# EAGLE design ctr_brd (EAGLE 9.6.2)
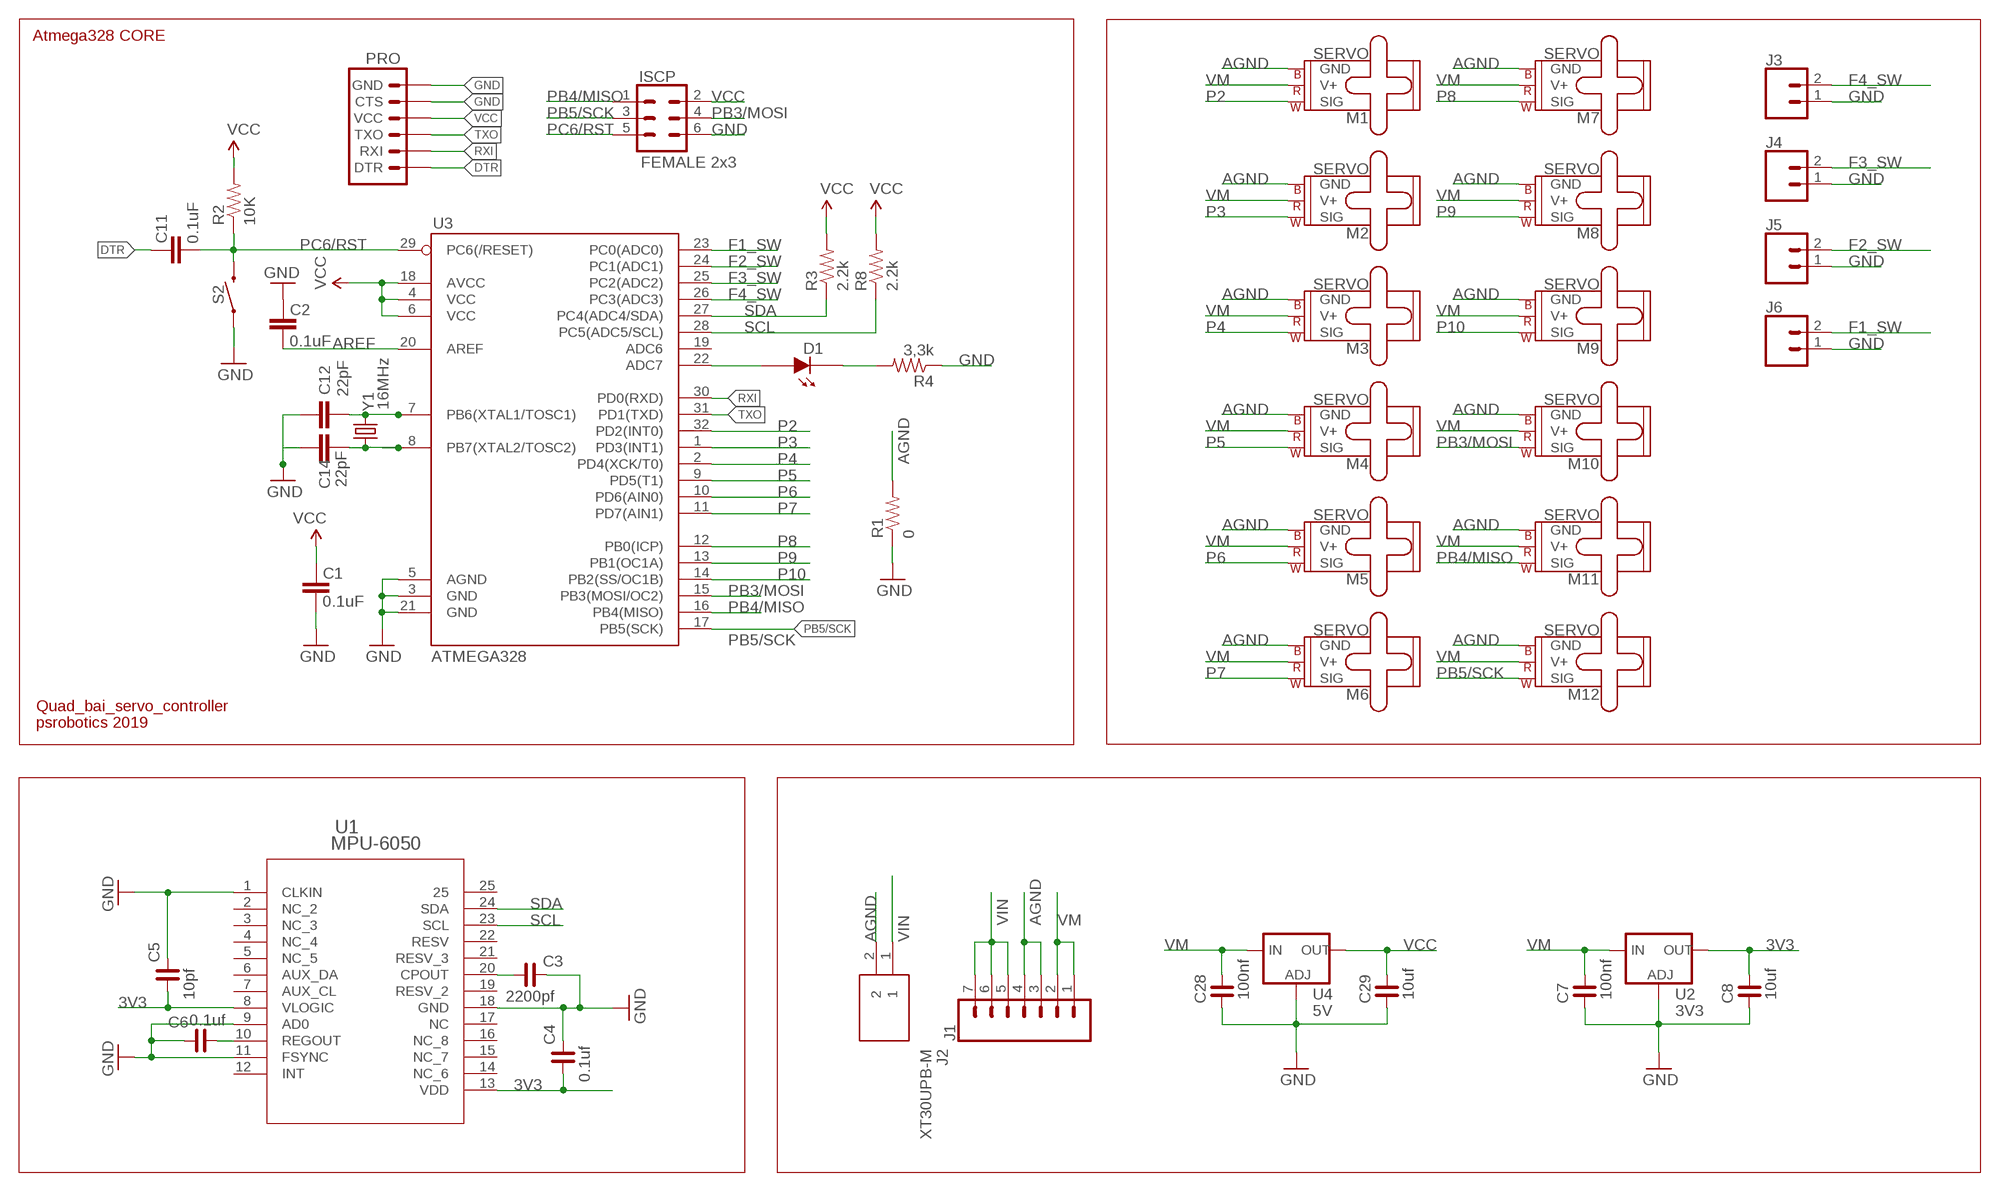
[diagram p0: schematic, sheet 1]

## Parts
C1  0.1uF  CAP0603-CAP  [0603-CAP]
C2  0.1uF  CAP0603-CAP  [0603-CAP]
C3  2200pf  C_0603  [C0603]
C4  0.1uf  C_0603  [C0603]
C5  10pf  C_0603  [C0603]
C6  0.1uf  C_0603  [C0603]
C7  100nf  C_0603  [C0603]
C8  10uf  C_0603  [C0603]
C11  0.1uF  CAP0603-CAP  [0603-CAP]
C12  22pF  22PF-0603-50V-5%  [0603]
C14  22pF  22PF-0603-50V-5%  [0603]
C28  100nf  C_0603  [C0603]
C29  10uf  C_0603  [C0603]
D1  LEDB  [0603P]
ISCP  FEMALE 2x3  CONN_03X2FEMALE  [2X3]
J1  CONN_07LONGPADS  [1X07_LONGPADS]
J2  XT30UPB-M  [SHDR2W160P0X500_1X2_1020X520X1]
J3  CONN_02LOCK  [1X02_LOCK]
J4  CONN_02LOCK  [1X02_LOCK]
J5  CONN_02LOCK  [1X02_LOCK]
J6  CONN_02LOCK  [1X02_LOCK]
M1  SERVO  [1X03]
M2  SERVO  [1X03]
M3  SERVO  [1X03]
M4  SERVO  [1X03]
M5  SERVO  [1X03]
M6  SERVO  [1X03]
M7  SERVO  [1X03]
M8  SERVO  [1X03]
M9  SERVO  [1X03]
M10  SERVO  [1X03]
M11  SERVO  [1X03]
M12  SERVO  [1X03]
PRO  FTDI Basic  ARDUINO_SERIAL_PROGRAMPTH  [1X06]
R1  0  RESISTOR0603-RES  [0603-RES]
R2  10K  RESISTOR0603-RES  [0603-RES]
R3  2.2k  RESISTOR0603-RES  [0603-RES]
R4  3,3k  RESISTOR0603-RES  [0603-RES]
R8  2.2k  RESISTOR0603-RES  [0603-RES]
S2  MOMENTARY-SWITCH-SPST-SMD-6.0X3.5MM  [TACTILE_SWITCH_SMD_6.0X3.5MM]
U1  MPU-6050  [QFN24_4X4X0P9_IVS]
U2  3V3  V_REG_LM1117SOT223  [SOT223]
U3  ATMEGA328  ATMEGA168  [TQFP32-08]
U4  5V  V_REG_LM1117SOT223  [SOT223]
Y1  16MHz  CRYSTAL-16MHZSMD-5X3.2  [CRYSTAL-SMD-5X3.2-4PAD]

## Nets
3V3: C4.1 C5.1 C8.2 U1.8(VLOGIC) U1.13(VDD) U2.2(OUT) U2.4(OUT)
AGND: J1.3 J1.4 J2.2 M1.3(GND) M2.3(GND) M3.3(GND) M4.3(GND) M5.3(GND) M6.3(GND) M7.3(GND) M8.3(GND) M9.3(GND) M10.3(GND) M11.3(GND) M12.3(GND) R1.2
AREF: C2.1 U3.20(AREF)
DTR: C11.2 PRO.1(DTR)
F1_SW: J6.2 U3.23(PC0(ADC0))
F2_SW: J5.2 U3.24(PC1(ADC1))
F3_SW: J4.2 U3.25(PC2(ADC2))
F4_SW: J3.2 U3.26(PC3(ADC3))
GND: C1.1 C2.2 C3.2 C4.2 C5.2 C6.2 C7.1 C8.1 C12.1 C14.1 C28.1 C29.1 ISCP.6 J3.1 J4.1 J5.1 J6.1 PRO.5(CTS) PRO.6(GND) R1.1 R4.1 S2.1 U1.1(CLKIN) U1.9(AD0) U1.11(FSYNC) U1.18(GND) U2.1(ADJ) U3.3(GND) U3.5(AGND) U3.21(GND) U4.1(ADJ)
N$1: C14.2 U3.8(PB7(XTAL2/TOSC2)) Y1.1
N$2: C12.2 U3.7(PB6(XTAL1/TOSC1)) Y1.3
N$3: C3.1 U1.20(CPOUT)
N$4: C6.1 U1.10(REGOUT)
N$5: D1.1(D_IN) U3.22(ADC7)
N$6: D1.2(D_OUT) R4.2
P2: M1.1(SIG) U3.32(PD2(INT0))
P3: M2.1(SIG) U3.1(PD3(INT1))
P4: M3.1(SIG) U3.2(PD4(XCK/T0))
P5: M4.1(SIG) U3.9(PD5(T1))
P6: M5.1(SIG) U3.10(PD6(AIN0))
P7: M6.1(SIG) U3.11(PD7(AIN1))
P8: M7.1(SIG) U3.12(PB0(ICP))
P9: M8.1(SIG) U3.13(PB1(OC1A))
P10: M9.1(SIG) U3.14(PB2(SS/OC1B))
PB3/MOSI: ISCP.4 M10.1(SIG) U3.15(PB3(MOSI/OC2))
PB4/MISO: ISCP.1 M11.1(SIG) U3.16(PB4(MISO))
PB5/SCK: ISCP.3 M12.1(SIG) U3.17(PB5(SCK))
PC6/RST: C11.1 ISCP.5 R2.1 S2.2 U3.29(PC6(/RESET))
RXI: PRO.2(RXI) U3.30(PD0(RXD))
SCL: R8.1 U1.23(SCL) U3.28(PC5(ADC5/SCL))
SDA: R3.1 U1.24(SDA) U3.27(PC4(ADC4/SDA))
TXO: PRO.3(TXO) U3.31(PD1(TXD))
VCC: C1.2 C29.2 ISCP.2 PRO.4(VCC) R2.2 R3.2 R8.2 U3.4(VCC) U3.6(VCC) U3.18(AVCC) U4.2(OUT) U4.4(OUT)
VIN: J1.5 J1.6 J1.7 J2.1
VM: C7.2 C28.2 J1.1 J1.2 M1.2(V+) M2.2(V+) M3.2(V+) M4.2(V+) M5.2(V+) M6.2(V+) M7.2(V+) M8.2(V+) M9.2(V+) M10.2(V+) M11.2(V+) M12.2(V+) U2.3(IN) U4.3(IN)
Unconnected: U1.2(NC_2) U1.3(NC_3) U1.4(NC_4) U1.5(NC_5) U1.6(AUX_DA) U1.7(AUX_CL) U1.12(INT) U1.14(NC_6) U1.15(NC_7) U1.16(NC_8) U1.17(NC) U1.19(RESV_2) U1.21(RESV_3) U1.22(RESV) U1.25 U3.19(ADC6)

## Notes on the sheet
- Atmega328 CORE
- Quad_bai_servo_controller
- psrobotics 2019

## Library data of the parts
C1 C2 C11 = SparkFun:CAP: Capacitor Standard 0603 ceramic capacitor, and 0.1" leaded capacitor.
C3-C8 C28 C29 = rc-master-smd:C_: NON-POLARIZED CAP
C12 C14 = SparkFun-Capacitors:22PF: 22pF ceramic capacitors A capacitor is a passive two-terminal electrical component used to store electrical energy temporarily in an electric field.; PROD_ID: CAP-07876
D1 = m-pad-2.1:LED: LED's in various packages
ISCP = SparkFun-Connectors:CONN_03X2: Multi connection point. Often used as Generic Header-pin footprint for 0.1 inch spaced/style header connections You can populate with any combo of single row headers, but if you'd like an exact match, check these: Header - 2x3 (Male, 0.1") <https://www.sparkfun.com/products/12807> (PRT-12807) Header - 2x3 (Female, 0.1") <https://www.sparkfun.com/products/13010> (PRT-13010) 2x3 Pin Shrouded Header <https://www.sparkfun.com/products/10877> (PRT-10877) On any of the 0.1 inch spaced packages, you can populate with these: Break Away Headers - Straight <https://www.sparkfun.com/products/116> (PRT-00116) Break Away Male Headers - Right Angle <https://www.sparkfun.com/products/553> (PRT-00553) Female Headers <https://www.sparkfun.com/products/115> (PRT-00115) Break Away Headers - Machine Pin <https://www.sparkfun.com/products/117> (PRT-00117) Break Away Female Headers - Swiss Machine Pin <https://www.sparkfun.com/products/743> (PRT-00743) Special note: the shrouded connector mates well with our 3x2 ribbon cables: Ribbon Crimp Connector - 6-pin (2x3, Female) <https://www.sparkfun.com/products/10651> (PRT-10651) Ribbon Cable - 6 wire (15ft) <https://www.sparkfun.com/products/10646> (PRT-10646); PROD_ID: CONN-11566
J1 = SparkFun-Connectors:CONN_07: Multi connection point. Often used as Generic Header-pin footprint for 0.1 inch spaced/style header connections On any of the 0.1 inch spaced packages, you can populate with these: Break Away Headers - Straight <https://www.sparkfun.com/products/116> (PRT-00116) Break Away Male Headers - Right Angle <https://www.sparkfun.com/products/553> (PRT-00553) Female Headers <https://www.sparkfun.com/products/115> (PRT-00115) Break Away Headers - Machine Pin <https://www.sparkfun.com/products/117> (PRT-00117) Break Away Female Headers - Swiss Machine Pin <https://www.sparkfun.com/products/743> (PRT-00743) For SCREWTERMINALS and SPRING TERMINALS visit here: Screw Terimnals on SparkFun.com <https://www.sparkfun.com/search/results?term=Screw+Terminals> (5mm/3.5mm/2.54mm spacing) This device is also useful as a general connection point to wire up your design to another part of your project. Our various solder wires solder well into these plated through hole pads. Hook-Up Wire - Assortment (Stranded, 22 AWG) <https://www.sparkfun.com/products/11375> (PRT-11375) Hook-Up Wire - Assortment (Solid Core, 22 AWG) <https://www.sparkfun.com/products/11367> (PRT-11367) View the entire wire category on our website here <https://www.sparkfun.com/categories/141> Special notes: Molex polarized connector foot print use with SKU : PRT-08231 with associated crimp pins and housings. 1MM SMD Version SKU: PRT-10208 NOTES ON THE VARIANTS LOCK and LOCK_LONGPADS... This footprint was designed to help hold the alignment of a through-hole component (i.e. 6-pin header) while soldering it into place. You may notice that each hole has been shifted either up or down by 0.005 of an inch from it's more standard position (which is a perfectly straight line). This slight alteration caused the pins (the squares in the middle) to touch the edges of the holes. Because they are alternating, it causes a "brace" to hold the component in place. 0.005 has proven to be the perfect amount of "off-center" position when using our standard breakaway headers. Although looks a little odd when you look at the bare footprint, once you have a header in there, the alteration is very hard to notice. Also,if you push a header all the way into place, it is covered up entirely on the bottom side.
J2 = XT30UPB-M:XT30UPB-M: Socket; DC supply; XT30; male; PIN: 2; on PCBs; THT; Colour: yellow Source: Datasheet <https://www.tme.eu/Document/4acc913878197f8c2e30d4b8cdc47230/XT30UPB SPEC.pdf>; DESCRIPTION: Socket; DC supply; XT30; male; PIN: 2; on PCBs; THT; Colour: yellow; HEIGHT: 10.7mm; MANUFACTURER_NAME: Amass; MANUFACTURER_PART_NUMBER: XT30UPB-M
J3-J6 = SparkFun-Connectors:CONN_02: Multi connection point. Often used as Generic Header-pin footprint for 0.1 inch spaced/style header connections On any of the 0.1 inch spaced packages, you can populate with these: Break Away Headers - Straight <https://www.sparkfun.com/products/116> (PRT-00116) Break Away Male Headers - Right Angle <https://www.sparkfun.com/products/553> (PRT-00553) Female Headers <https://www.sparkfun.com/products/115> (PRT-00115) Break Away Headers - Machine Pin <https://www.sparkfun.com/products/117> (PRT-00117) Break Away Female Headers - Swiss Machine Pin <https://www.sparkfun.com/products/743> (PRT-00743) For SCREWTERMINALS and SPRING TERMINALS visit here: Screw Terimnals on SparkFun.com <https://www.sparkfun.com/search/results?term=Screw+Terminals> (5mm/3.5mm/2.54mm spacing) This device is also useful as a general connection point to wire up your design to another part of your project. Our various solder wires solder well into these plated through hole pads. Hook-Up Wire - Assortment (Stranded, 22 AWG) <https://www.sparkfun.com/products/11375> (PRT-11375) Hook-Up Wire - Assortment (Solid Core, 22 AWG) <https://www.sparkfun.com/products/11367> (PRT-11367) View the entire wire category on our website here <https://www.sparkfun.com/categories/141> Special notes: Molex polarized connector foot print use with: PRT-08233 with associated crimp pins and housings. 2.54_SCREWTERM for use with PRT-10571. 3.5mm Screw Terminal footprints for PRT-08084 5mm Screw Terminal footprints for use with PRT-08432
M1-M12 = SparkFun-Electromechanical:SERVO: Servo Motor 3-pin connector for a standard servo motor (voltage supply, ground, and control signal.) SparkFun Products Servo - Generic (Sub-Micro Size) <https://www.sparkfun.com/products/9065> (ROB-09065) Servo - Generic High Torque Continuous Rotation (Standard Size) <https://www.sparkfun.com/products/9347> (ROB-09347) Servo - Generic High Torque (Standard Size) <https://www.sparkfun.com/products/11965> (ROB-11965)
PRO = SparkFun:ARDUINO_SERIAL_PROGRAM
R1-R4 R8 = SparkFun:RESISTOR: Resistor Basic schematic elements and footprints for 0603, 1206, and PTH resistors.
S2 = SparkFun-Switches:MOMENTARY-SWITCH-SPST: Momentary Switch (Pushbutton) - SPST Normally-open (NO) SPST momentary switches (buttons, pushbuttons). Variants PTH-12MM - 12mm square, through-hole Momentary Pushbutton Switch - 12mm Square <https://www.sparkfun.com/products/9190> (COM-09190) PTH-6.0MM, PTH-6.0MM-KIT - 6.0mm square, through-hole Mini Pushbutton Switch <https://www.sparkfun.com/products/97> (COM-00097) KIT package intended for soldering kit's - only one side of pads' copper is exposed. PTH-RIGHT-ANGLE-KIT - Right-angle, through-hole Right Angle Tactile Button <https://www.sparkfun.com/products/10791> - Used on SparkFun BigTime Watch Kit <https://www.sparkfun.com/products/11734> SMD-12MM - 12mm square, surface-mount Tactile Button - SMD (12mm) <https://www.sparkfun.com/products/12993> (COM-12993) Used on SparkFun PicoBoard <https://www.sparkfun.com/products/11888> SMD-4.5MM - 4.5mm Square Trackball Switch Used on SparkFun Blackberry Trackballer Breakout <https://www.sparkfun.com/products/13169> SMD-4.6MMX2.8MM - 4.60mm x 2.80mm, surface mount Used on SparkFun SAMD21 Mini Breakout <https://www.sparkfun.com/products/13664> SMD-5.2MM, SMD-5.2-REDUNDANT - 5.2mm square, surface-mount Mini Pushbutton Switch - SMD <https://www.sparkfun.com/products/8720> (COM-08720) Used on Arduino Pro Mini <https://www.sparkfun.com/products/11114> REDUNDANT package connects both switch circuits together SMD-6.0X3.5MM - 6.0 x 3.5mm, surface mount Momentary Reset Switch SMD <https://www.sparkfun.com/products/8229> (COM-08229) SMD-6.2MM-TALL - 6.2mm square, surface mount Tactile Button - SMD (6mm) <https://www.sparkfun.com/products/12992> Used on SparkFun Digital Sandbox <https://www.sparkfun.com/products/12651> SMD-RIGHT-ANGLE - Right-angle, surface mount Used on SparkFun Block for Intel® Edison - Arduino <https://www.sparkfun.com/products/13036>; PROD_ID: SWCH-00815; SF_SKU: COM-08229
U1 = MPU6050:MPU-6050; BUILT_BY: EMA_Cory; COPYRIGHT: Copyright (C) 2018 Accelerated Designs. All rights reserved; MANUFACTURER_PART_NUMBER: MPU-6050; SOURCELIBRARY: InvenSense_2019-12-03; VENDOR: IvenSense
U2 U4 = SparkFun-IC-Power:V_REG_LM1117: Voltage Regulator LM1117 Standard adjustable voltage regulator but in SMD form. Spark Fun Electronics SKU : COM-00595; PROD_ID: VREG-08170
U3 = SparkFun:ATMEGA168
Y1 = SparkFun-Clocks:CRYSTAL-16MHZ: 16MHz Crystal Digikey Example <http://www.digikey.com/product-search/en?keywords=535-9122-1-ND> Frequency: 16MHz Frequency Stability: ±50ppm Frequency Tolerance: ±20ppm Load Capacitance: 18pF SparkFun Products: Pro Micro -5V/16MHz <https://www.sparkfun.com/products/12640> SparkFun Serial Enabled LCD Kit <https://www.sparkfun.com/products/10097>; PROD_ID: XTAL-08218; SF_ID: COM-00094

## Net classes
0 default: width 0.203 mm
1 vcc: width 0.254 mm

## Board
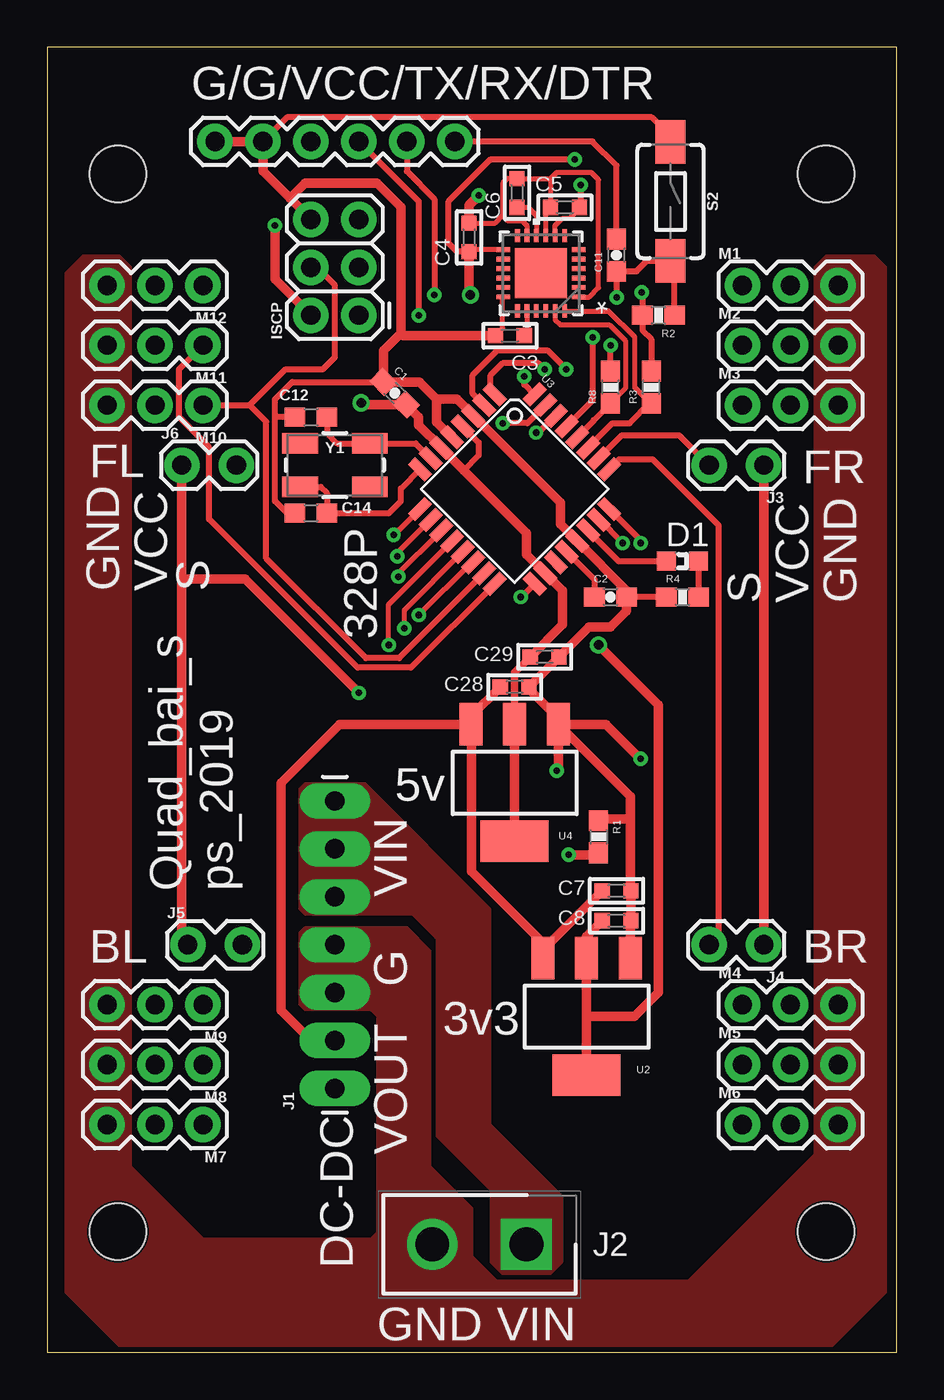
[diagram p1: board, top side]
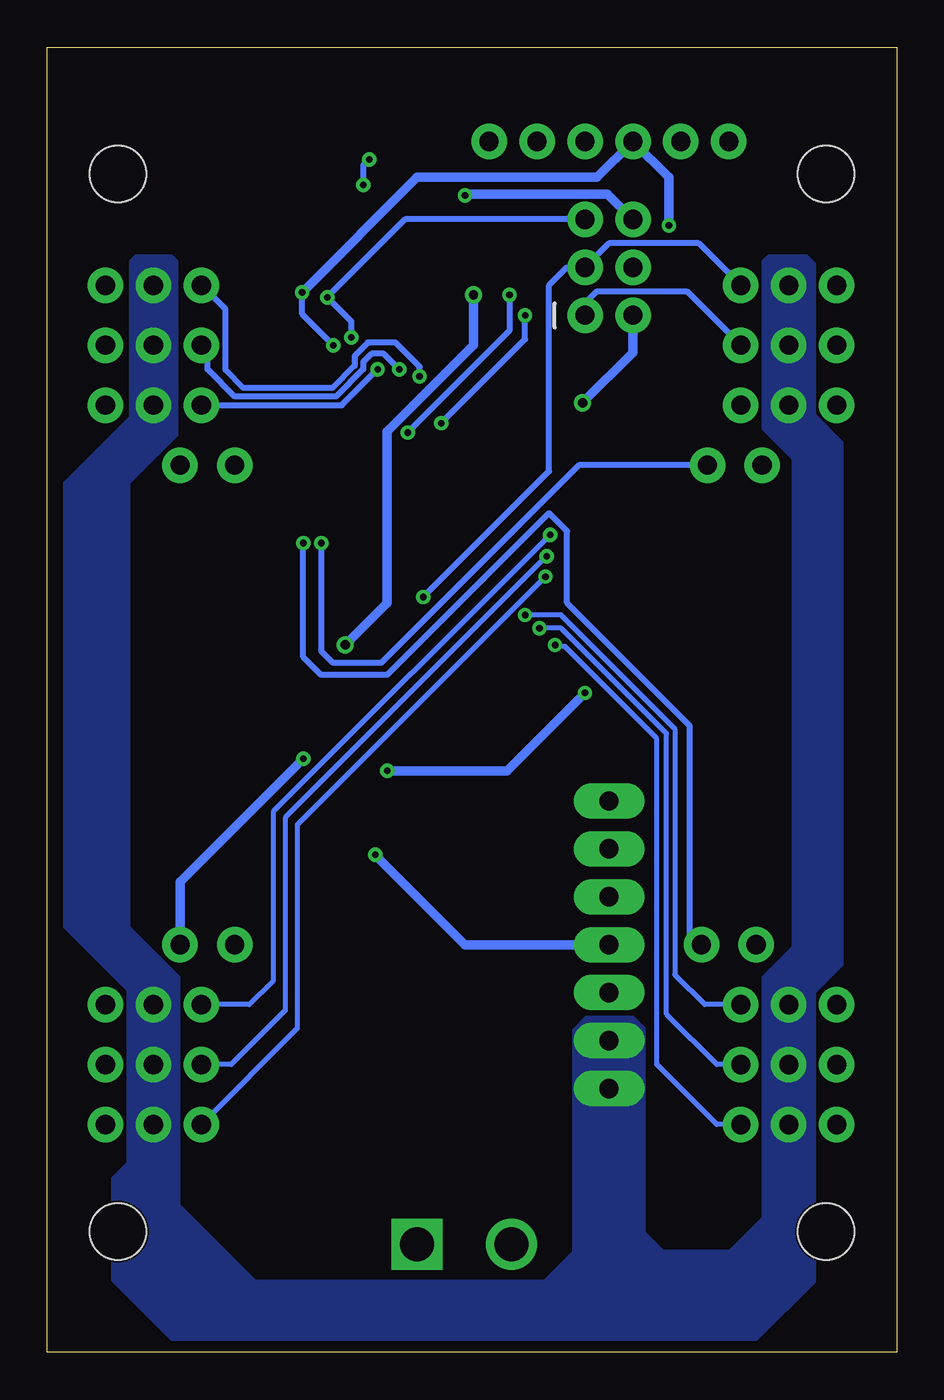
[diagram p2: board, bottom side, seen from below]

Size 45 x 69.13 mm. Coordinates in mm from the lower left corner, seen from the top.
Outline: 0,0 45,0 45,69.13 0,69.13 0,0
Copper layers (1*16): Top 0.035mm / dielectric 1.5mm / Bottom 0.035mm
Design rules "default *": minimum track width 6mil, minimum drill 0.35mm, track to track 6mil, track to pad 6mil, pad to pad 6mil, via to via 6mil, smd to smd 6mil, copper to edge 5mil, drill to drill 6mil, minimum pad ring 10mil, minimum via ring 8mil, stop-mask expansion 4mil, vias tented up to drill 22mil, thermal gap 10mil
Holes 3 mm at 3.75,6.41 3.75,62.41 41.25,6.41 41.25,62.41

### Footprints (pad centres in the part's own frame; a part is rotated, then mirrored left to right if it is on the bottom)
0603-CAP = smd 1.1 x 1: 1 -0.85,0; 2 0.85,0
C0603 = smd 0.8 x 0.8: 1 -0.762,0; 2 0.762,0
0603 = smd 1.1 x 1: 1 -0.85,0; 2 0.85,0
0603P = smd 1 x 1: 1 -0.85,0; 2 0.85,0
2X3 = drill 1.016 pad 1.88: 1 0,0; 2 0,2.54; 3 2.54,0; 4 2.54,2.54; 5 5.08,0; 6 5.08,2.54
1X07_LONGPADS = drill 1.016 pad 1.88 long: 1 0,0; 2 2.54,0; 3 5.08,0; 4 7.62,0; 5 10.16,0; 6 12.7,0; 7 15.24,0
SHDR2W160P0X500_1X2_1020X520X1 = drill 1.8 pad 2.7 square: 1 0,0 | drill 1.8 pad 2.7: 2 5,0
1X02_LOCK = drill 1.016 pad 1.88: 1 -0.178,0; 2 2.718,0
1X03 = drill 1.016 pad 1.88: 1 0,0; 2 2.54,0; 3 5.08,0
1X06 = drill 1.016 pad 1.88: 1 0,0; 2 2.54,0; 3 5.08,0; 4 7.62,0; 5 10.16,0; 6 12.7,0
0603-RES = smd 1.1 x 1: 1 -0.85,0; 2 0.85,0
TACTILE_SWITCH_SMD_6.0X3.5MM = smd 2.3 x 1.6: 1 -3.15,0; 2 3.15,0
QFN24_4X4X0P9_IVS = smd 0.711 x 0.254: 1 -1.994,1.25; 2 -1.994,0.75; 3 -1.994,0.25; 4 -1.994,-0.25; 5 -1.994,-0.75; 6 -1.994,-1.25; 13 1.994,-1.25; 14 1.994,-0.75; 15 1.994,-0.25; 16 1.994,0.25; 17 1.994,0.75; 18 1.994,1.25 | smd 0.254 x 0.711: 7 -1.25,-1.994; 8 -0.75,-1.994; 9 -0.25,-1.994; 10 0.25,-1.994; 11 0.75,-1.994; 12 1.25,-1.994; 19 1.25,1.994; 20 0.75,1.994; 21 0.25,1.994; 22 -0.25,1.994; 23 -0.75,1.994; 24 -1.25,1.994 | smd 2.743 x 2.642: 25 0,0
SOT223 = smd 1.219 x 2.235: 1 -2.311,-3.099; 2 0,-3.099; 3 2.311,-3.099 | smd 3.6 x 2.2: 4 0,3.099
TQFP32-08 = smd 1.27 x 0.559: 1 -4.293,2.8; 2 -4.293,2; 3 -4.293,1.2; 4 -4.293,0.4; 5 -4.293,-0.4; 6 -4.293,-1.2; 7 -4.293,-2; 8 -4.293,-2.8; 17 4.293,-2.8; 18 4.293,-2; 19 4.293,-1.2; 20 4.293,-0.4; 21 4.293,0.4; 22 4.293,1.2; 23 4.293,2; 24 4.293,2.8 | smd 0.559 x 1.27: 9 -2.8,-4.293; 10 -2,-4.293; 11 -1.2,-4.293; 12 -0.4,-4.293; 13 0.4,-4.293; 14 1.2,-4.293; 15 2,-4.293; 16 2.8,-4.293; 25 2.8,4.293; 26 2,4.293; 27 1.2,4.293; 28 0.4,4.293; 29 -0.4,4.293; 30 -1.2,4.293; 31 -2,4.293; 32 -2.8,4.293
CRYSTAL-SMD-5X3.2-4PAD = smd 1.9 x 1.1: 1 -1.85,-1.15; 2 1.85,-1.15; 3 1.85,1.15; 4 -1.85,1.15

### Placement (x,y rotation side)
C1  18.41,50.8 315 top
C2  29.84,40.01 0 top
C3  24.51,53.85 180 top
C4  22.35,59.05 90 top
C5  27.43,60.64 180 top
C6  24.89,61.4 90 top
C7  30.16,24.45 180 top
C8  30.16,22.86 180 top
C11  30.16,58.1 90 top
C12  13.97,49.53 0 top
C14  13.97,44.45 0 top
C28  24.77,35.24 180 top
C29  26.35,36.83 180 top
D1  33.66,41.91 0 top
ISCP  16.51,54.93 90 top
J1  15.24,13.97 90 top
J2  25.4,5.71 180 top
J3  37.78,46.99 180 top
J4  37.78,21.59 180 top
J5  7.62,21.59 0 top
J6  7.3,46.99 0 top
M1  36.83,56.52 0 top
M2  36.83,53.34 0 top
M3  36.83,50.16 0 top
M4  36.83,18.42 0 top
M5  36.83,15.24 0 top
M6  36.83,12.06 0 top
M7  8.26,12.06 180 top
M8  8.26,15.24 180 top
M9  8.26,18.42 180 top
M10  8.26,50.16 180 top
M11  8.26,53.34 180 top
M12  8.26,56.52 180 top
PRO  21.59,64.13 180 top
R1  29.21,27.3 270 top
R2  32.38,54.93 180 top
R3  32,51.12 90 top
R4  33.66,40.01 0 top
R8  29.84,51.12 90 top
S2  33.02,60.96 270 top
U1  26.16,57.15 180 top
U2  28.57,17.78 180 top
U3  24.77,45.72 315 top
U4  24.77,30.16 180 top
Y1  15.24,46.99 0 top

### Tracks (layer width: path | path; a pad name or v marks a point on that pad's centre or on a via)
3V3  (via drill 0.35, 0.5)
  Top 0.254: U1.8 26.91,59.68 27.3,60.07 27.69,60.07 28.19,60.58 C5.1 | U1.13 22.46,58.4 C4.1
  Top 0.305: C4.1 21.72,58.29 21.27,58.74 21.27,60.96 23.5,63.18 v27.94,63.18 | v28.26,61.83 28.26,60.64 28.19,60.58
  Top 0.508: C4.1 22.35,56.07 v22.42,56.01 | 28.57,17.78 U2.2 28.57,22.04 C8.2 | 28.57,17.78 U2.4 | 28.57,17.78 31.11,17.78 32.38,19.05 32.38,34.29 v29.21,37.47
  Bottom 0.305: v27.94,63.18 28.26,62.87 v28.26,61.83
  Bottom 0.508: v22.42,56.01 22.42,53.34 26.99,48.77 26.99,39.69 v29.21,37.47
AGND  (via drill 0.35)
  Top 0.508: R1.2 29.11,26.35 v27.62,26.35
  Bottom 0.508: v27.62,26.35 22.86,21.59 J1.4
  pour Top (no thermals): 13.65,22.54 19.05,22.54 20.32,21.27 20.32,9.84 22.54,7.62 22.54,5.4 21.34,4.19 19.18,4.19 17.46,5.91 17.46,17.78 17.14,18.1 13.65,18.1 13.34,18.42 13.34,22.23
  pour Top (no thermals): 1.91,58.1 3.81,58.1 4.45,57.47 4.45,9.84 8.26,6.03 17.14,6.03 17.78,6.67 21.91,6.67 22.54,6.03 22.54,5.08 23.81,3.81 33.97,3.81 40.64,10.48 40.64,57.47 41.27,58.1 43.81,58.1 44.45,57.47 44.45,3.17 41.59,0.32 3.81,0.32 0.95,3.17 0.95,57.15
AREF
  Top 0.305: U3.20 29,40.92 C2.1
DTR
  Top 0.305: C11.2 30.16,62.87 28.89,64.13 PRO.1
F1_SW  (via drill 0.35)
  Top 0.305: U3.23 29.24,44.1 v30.48,42.86
  Bottom 0.305: J6.2 16.83,46.99 27.3,36.51 29.84,36.51 30.48,37.15 v30.48,42.86
F2_SW  (via drill 0.35)
  Top 0.305: v31.43,42.86 31.43,43.01 U3.24
  Bottom 0.305: J5.2 10.97,22.23 10.97,33.2 17.46,39.69 17.46,43.5 18.41,44.45 26.99,35.88 30.48,35.88 31.43,36.83 v31.43,42.86
F3_SW
  Top 0.305: U3.25 30.31,47.31 32.07,47.31 35.56,43.81 35.56,22.09 J4.2
F4_SW
  Top 0.305: U3.26 30.45,48.58 33.48,48.58 J3.2
GND  (via drill 0.35)
  Top 0.254: C3.2 24.13,54.23 24.13,55.86 U1.18 | U1.1 28.72,55.9 29.21,56.39 29.21,62.1 28.83,62.48 26.99,62.48 26.67,62.17 | 26.67,62.17 C5.2 26.41,60.38 U1.9 | 24.13,60.21 24.39,59.94 25.15,59.94 25.41,59.68 U1.11 | 24.13,60.21 24.13,61.91 24.38,62.17 C6.2 26.67,62.17 | C4.2 23.74,59.82 24.13,60.21
  Top 0.305: 30.7,40.36 C2.2 R4.1 | C14.1 12.7,44.45 12.06,45.09 12.06,49.53 | 12.06,49.53 12.06,50.48 12.98,51.4 C1.1 | C12.1 12.06,49.53 | S2.1 33.02,64.43 32.03,65.42 12.7,65.42 11.43,64.15 PRO.5
  Top 0.508: 20.64,50.48 19.72,51.4 C1.1 17.81,53.06 18.73,53.98 | 30.7,40.36 U3.21 27.18,43.87 27.18,45 U3.3 21.7,50.48 20.64,50.48 | PRO.6 PRO.5 11.43,62.55 12.86,61.12 | 12.86,61.12 ISCP.6 | 18.73,53.98 18.73,60.64 17.46,61.91 13.65,61.91 12.86,61.12 | C3.2 18.86,53.85 18.73,53.98 | v22.87,61.27 22.35,60.76 C4.2 | U3.5 20.64,49.28 20.64,50.48 | U4.1 27.08,33.58 25.53,35.13 C28.1 C29.1 28.7,38.42 29.84,38.42 30.7,39.27 C2.2 | U4.1 30.89,29.45 30.89,28.26 | 30.89,28.26 30.89,24.49 C7.1 C8.1 30.89,22.82 U2.1 | J6.1 7.12,40.96 | 7.12,40.96 7.12,21.91 J5.1 | J3.1 J4.1 | U4.1 29.6,33.26 v31.43,31.43 | R1.1 29.31,28.26 30.89,28.26 | U4.1 27.08,30.89 v26.99,30.8 | v16.51,34.93 10.48,40.96 7.12,40.96
  Bottom 0.508: v22.87,61.27 22.78,61.35 15.32,61.35 ISCP.6 | v31.43,31.43 37.96,24.91 J4.1 | v26.99,30.8 20.64,30.8 v16.51,34.93
N$1
  Top 0.305: Y1.1 14.48,45.84 14.82,45.51 C14.2 18.1,44.45 18.73,45.09 18.73,45.76 U3.8
N$2
  Top 0.305: U3.7 19.52,48.14 Y1.3 15.36,48.14 14.82,48.68 C12.2
N$3
  Top 0.254: U1.20 25.41,53.99 C3.1
N$4
  Top 0.254: C6.1 25.46,60.64 25.91,60.19 U1.10
N$5
  Top 0.305: U3.22 30.27,41.91 D1.1
N$6
  Top 0.305: D1.2 R4.2
P2  (via drill 0.35)
  Top 0.305: U3.32 25.78,50.73 25.27,51.25 v25.27,51.69
  Bottom 0.305: v25.27,51.69 25.27,52.2 26.56,53.48 28,53.48 28.71,52.77 28.71,52.26 29.89,51.08 34.61,51.08 35.56,52.03 35.56,55.25 M1.1
P3  (via drill 0.35)
  Top 0.305: U3.1 23.5,50.95 23.5,51.75 24.13,52.39 26.04,52.39 v26.35,52.07
  Bottom 0.305: v26.35,52.07 27.18,52.9 27.81,52.9 28.26,52.45 28.26,52.07 29.7,50.62 35.06,50.62 36.51,52.07 36.51,53.02 M2.1
P4  (via drill 0.35)
  Top 0.305: U3.2 22.54,50.77 22.54,51.75 23.86,53.07 26.5,53.07 v27.5,52.07
  Bottom 0.305: M3.1 29.4,50.16 v27.5,52.07
P5  (via drill 0.35)
  Top 0.254: U3.9 18.39,43.31 v18.35,43.31
  Bottom 0.254: v18.35,43.31 33.02,28.64 33.02,19.69 34.29,18.42 M4.1
P6  (via drill 0.35)
  Top 0.254: U3.10 18.54,42.33 v18.54,42.16
  Bottom 0.254: v18.54,42.16 32.38,28.32 32.38,18.1 35.24,15.24 M5.1
P7  (via drill 0.35)
  Top 0.254: U3.11 18.43,41.08 v18.61,41.08
  Bottom 0.254: v18.61,41.08 31.75,27.94 31.75,17.14 M6.1
P8  (via drill 0.35)
  Top 0.254: v18.1,37.47 18.07,37.49 18.07,39.6 U3.12
  Bottom 0.254: M7.1 9.53,12.06 12.7,15.24 12.7,32.51 17.59,37.4 18.03,37.4 v18.1,37.47
P9  (via drill 0.35)
  Top 0.254: v18.92,38.35 18.92,39.31 U3.13
  Bottom 0.254: M8.1 9.53,15.24 12.19,17.91 12.19,32.77 17.78,38.35 v18.92,38.35
P10  (via drill 0.35)
  Top 0.254: v19.68,39.05 22.47,41.84 U3.14
  Bottom 0.254: M9.1 10.16,18.42 11.75,20 11.75,33.02 17.78,39.05 v19.68,39.05
PB3/MOSI
  Top 0.305: U3.15 18.64,36.77 16.89,36.77 11.61,42.05 11.61,49.29 10.73,50.16 | M10.1 10.73,50.16 | ISCP.4 14.29,57.47 15.24,56.52 15.24,52.7 14.61,52.07 12.64,52.07 10.73,50.16
PB4/MISO
  Top 0.305: U3.16 19.26,36.26 16.45,36.26 8.57,44.13 8.57,47.94 6.99,49.53 6.99,52.07 M11.1
  Bottom 0.305: ISCP.1 16.51,55.56 15.88,56.2 11.11,56.2 M11.1
PB5/SCK  (via drill 0.35)
  Top 0.305: U3.17 25.12,40.01 v25.08,40.01
  Bottom 0.305: v25.08,40.01 18.41,46.67 18.41,56.52 17.46,57.47 ISCP.3 15.24,58.74 10.48,58.74 M12.1
PC6/RST  (via drill 0.35)
  Top 0.305: R2.1 33.23,57.59 S2.2 31.77,57.81 31.22,57.25 C11.1 v30.16,55.88 | v28.89,53.76 28.89,50.41 U3.29
  Bottom 0.305: ISCP.5 26.04,60.01 v30.16,55.88 28.89,54.61 v28.89,53.76
RXI  (via drill 0.35)
  Top 0.305: PRO.2 19.05,62.55 20.51,61.09 v20.51,56.01 | v25.9,48.72 26.02,48.72 26.91,49.6 U3.30
  Bottom 0.305: v20.51,56.01 20.51,54.1 v25.9,48.72
SCL
  Top 0.254: U1.23 26.91,54.69 27.18,54.42 29.78,54.42 30.62,53.58 30.62,51.05 R8.1
  Top 0.305: U3.28 28.96,49.34 28.96,49.38 R8.1
SDA
  Top 0.254: U1.24 29.74,55.16 31.11,53.79 31.11,51.12 31.96,50.27 R3.1
  Top 0.305: U3.27 29.95,49.21 30.86,49.21 31.92,50.27 R3.1
TXO  (via drill 0.35)
  Top 0.305: PRO.3 19.68,60.96 v19.68,54.93 | v24.13,49.21 v24.14,49.22 25.43,49.22 U3.31
  Bottom 0.305: v24.13,49.21 19.68,53.66 v19.68,54.93
VCC  (via drill 0.35, 0.5)
  Top 0.305: U3.4 22.86,48.19 22.86,47.5 22.07,46.71 | R3.2 32,53.66 31.54,54.13 R2.2 31.54,56.09 v31.5,56.13 | R8.2 v29.84,53.34
  Top 0.406: U4.2 24.77,36 C29.2
  Top 0.508: v16.64,50.29 16.73,50.2 C1.2 19.68,49.53 19.68,49.1 U3.6 22.07,46.71 25.4,43.39 25.4,42.26 U3.18 27.3,40.35 27.3,38.54 C29.2 | v12.06,59.69 12.06,56.83 ISCP.2 | U4.2 U4.4
  Bottom 0.305: v29.84,53.34 31.5,54.99 v31.5,56.13
  Bottom 0.508: ISCP.2 13.97,52.96 v16.64,50.29 | v12.06,59.69 12.06,62.23 PRO.4 15.88,62.23 25.4,62.23 v31.5,56.13
VIN
  pour Top (no thermals): 13.65,30.16 16.83,30.16 23.5,23.5 23.5,12.06 27.3,8.25 27.3,4.76 26.67,4.13 24.13,4.13 23.5,4.76 23.5,8.57 20.64,11.43 20.64,21.91 19.37,23.18 13.65,23.18 13.34,23.5 13.34,29.85
VM
  Top 0.508: C7.2 26.26,21.31 U2.3 26.26,21.68 22.48,25.46 22.48,33.24 U4.3 | U4.3 22.45,33.69 C28.2 | J1.2 13.97,16.51 12.38,18.1 12.38,30.16 15.48,33.26 U4.3
  pour Bottom (no thermals): 4.76,58.1 4.32,57.66 4.32,49.66 2.86,48.2 2.86,20.51 4.32,19.05 4.32,3.75 7.43,0.64 38.42,0.64 41.59,3.81 41.59,9.21 40.77,10.03 40.77,19.18 44.13,22.54 44.13,46.04 40.64,49.53 40.64,57.79 40.32,58.1 38.42,58.1 38.1,57.79 38.1,48.58 40.64,46.04 40.64,22.54 37.97,19.88 37.97,7.81 33.97,3.81 18.67,3.81 17.14,5.33 17.14,17.08 16.45,17.78 13.97,17.78 13.34,17.14 13.34,6.35 12.38,5.4 8.83,5.4 7.11,7.11 7.11,19.88 5.52,21.46 5.52,47.31 7.11,48.9 7.11,57.79 6.79,58.1

### Text on the board
tPlace: G/G/VCC/TX/RX/DTR | FL | FR | GND | VCC | S | S | VCC | GND | 328P | 5v | Quad_bai_s / ps_2019 | VIN | BL | BR | G | 3v3 | VOUT | DC-DC | GND | VIN